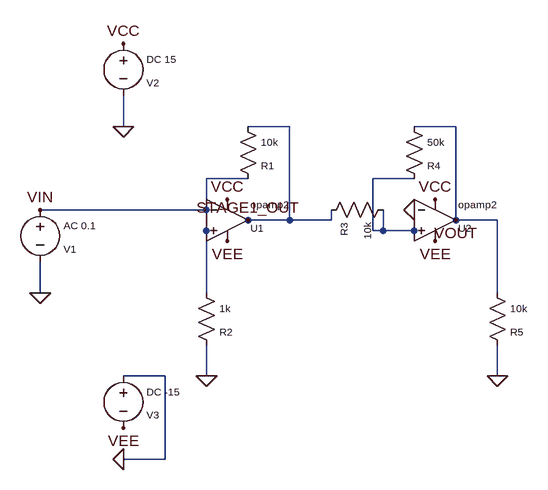
[diagram p0: schematic dual_opamp_cascade_unbeautified.asc]
dual_opamp_cascade_unbeautified.asc, the LTspice schematic file:
Version 4
SHEET 1 1224 1224
WIRE 100 484 356 484
WIRE 100 564 100 612
WIRE 420 500 484 500
WIRE 484 500 484 356
WIRE 484 356 420 356
WIRE 420 436 356 436
WIRE 356 436 356 516
WIRE 356 516 356 612
WIRE 356 692 356 740
WIRE 420 500 548 500
WIRE 548 500 548 484
WIRE 628 484 628 516
WIRE 628 516 676 516
WIRE 740 500 740 356
WIRE 740 356 676 356
WIRE 676 436 612 436
WIRE 612 436 612 516
WIRE 612 516 676 516
WIRE 740 500 804 500
WIRE 804 500 804 612
WIRE 804 692 804 740
WIRE 228 308 228 356
WIRE 228 740 292 740
WIRE 292 740 292 868
WIRE 292 868 228 868
FLAG 676 484 0
FLAG 388 468 VCC
FLAG 708 468 VCC
FLAG 228 228 VCC
FLAG 388 532 VEE
FLAG 708 532 VEE
FLAG 228 820 VEE
FLAG 100 484 VIN
FLAG 420 500 STAGE1_OUT
FLAG 740 500 VOUT
SYMBOL voltage 100 468 R0
SYMATTR InstName V1
WINDOW 0 36 76 Left 1
SYMATTR Value AC 0.1
WINDOW 3 36 40 Left 1
FLAG 100 612 0
SYMBOL opamp2 388 436 R0
SYMATTR InstName U1
WINDOW 0 36 76 Left 1
WINDOW 3 36 40 Left 1
SYMBOL res 404 340 R0
SYMATTR InstName R1
WINDOW 0 36 76 Left 1
SYMATTR Value 10k
WINDOW 3 36 40 Left 1
SYMBOL res 340 596 R0
SYMATTR InstName R2
WINDOW 0 36 76 Left 1
SYMATTR Value 1k
WINDOW 3 36 40 Left 1
FLAG 356 740 0
SYMBOL opamp2 708 436 R0
SYMATTR InstName U2
WINDOW 0 36 76 Left 1
WINDOW 3 36 40 Left 1
SYMBOL res 644 468 R90
SYMATTR InstName R3
WINDOW 0 36 76 Left 1
SYMATTR Value 10k
WINDOW 3 36 40 Left 1
SYMBOL res 660 340 R0
SYMATTR InstName R4
WINDOW 0 36 76 Left 1
SYMATTR Value 50k
WINDOW 3 36 40 Left 1
SYMBOL res 788 596 R0
SYMATTR InstName R5
WINDOW 0 36 76 Left 1
SYMATTR Value 10k
WINDOW 3 36 40 Left 1
FLAG 804 740 0
SYMBOL voltage 228 212 R0
SYMATTR InstName V2
WINDOW 0 36 76 Left 1
SYMATTR Value DC 15
WINDOW 3 36 40 Left 1
FLAG 228 356 0
SYMBOL voltage 228 724 R0
SYMATTR InstName V3
WINDOW 0 36 76 Left 1
SYMATTR Value DC -15
WINDOW 3 36 40 Left 1
FLAG 228 868 0

The netlist it stands for:
* dual_opamp_cascade_unbeautified.asc
V1 VIN 0 AC 0.1
XU1 VIN VIN VCC VEE STAGE1_OUT opamp2  ; pins In+ In- V+ V- OUT
R1 STAGE1_OUT VIN 10k
R2 VIN 0 1k
XU2 N001 0 VCC VEE VOUT opamp2  ; pins In+ In- V+ V- OUT
R3 N001 STAGE1_OUT 10k
R4 VOUT N001 50k
R5 VOUT 0 10k
V2 VCC 0 DC 15
V3 0 VEE DC -15
.backanno
.end